# EAGLE design umodular_ctrl16 (EAGLE 7.2.0)

## Sheet 1 of 2
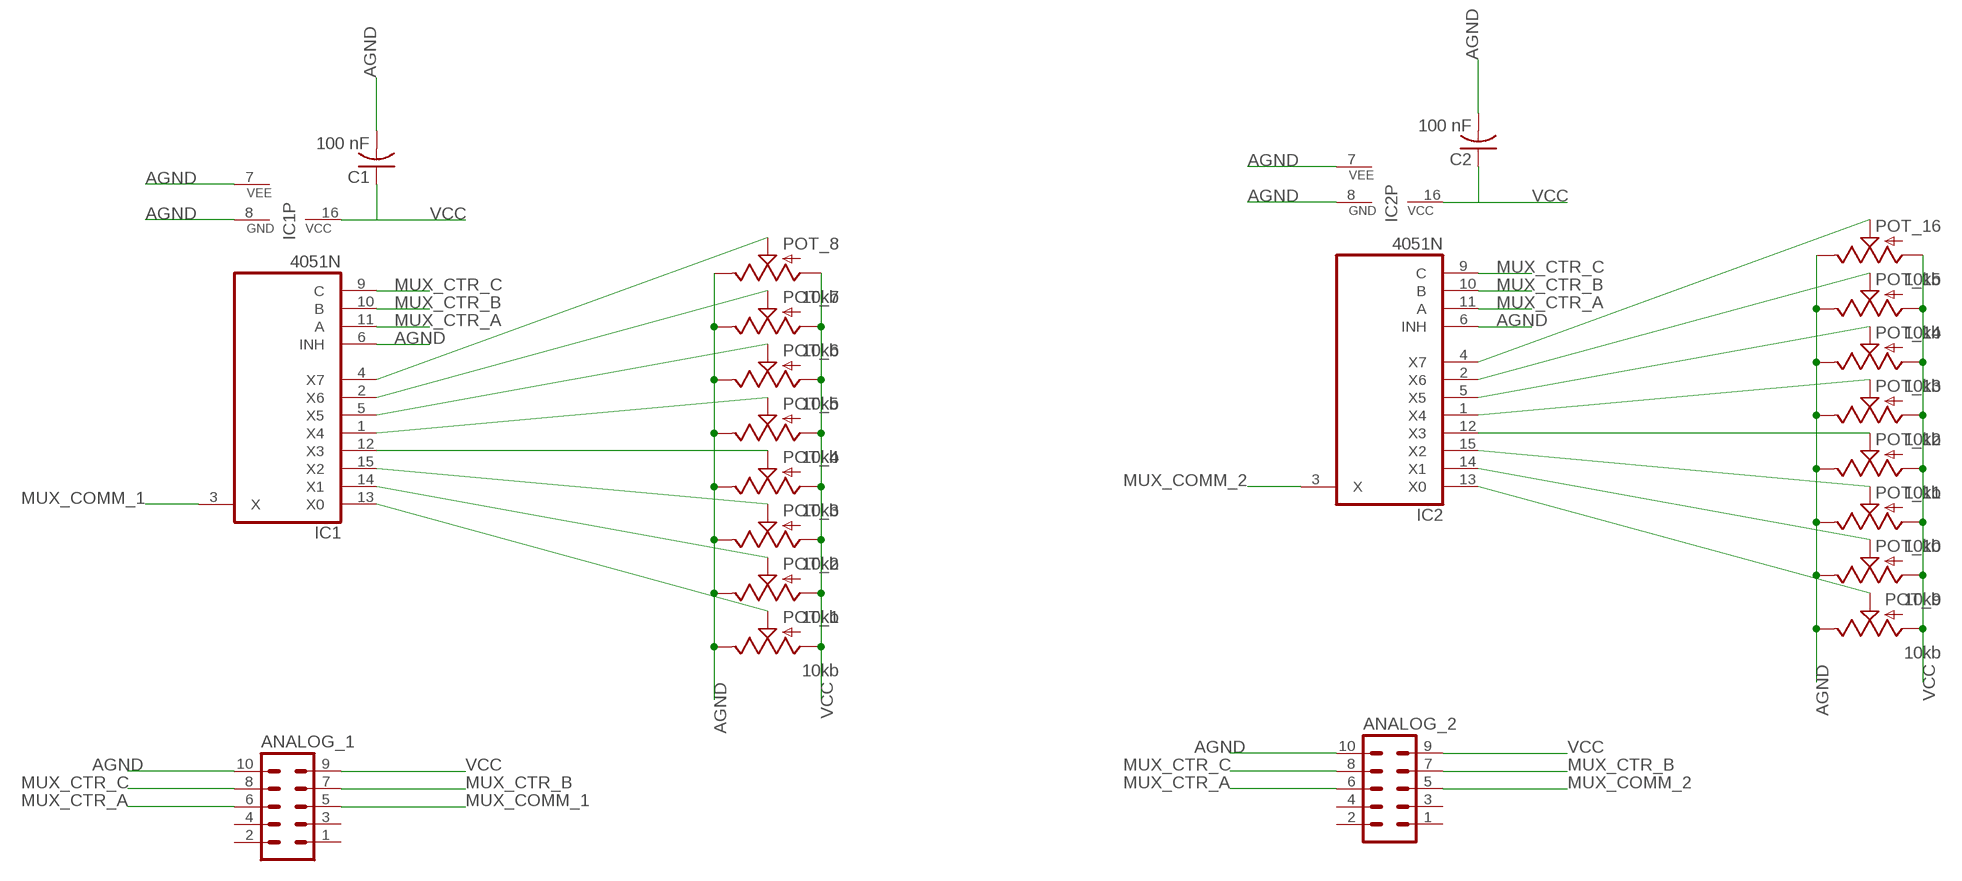
[diagram p0: schematic, sheet 1]

### Parts
ANALOG_1  MA05-2  [MA05-2]
ANALOG_2  MA05-2  [MA05-2]
C1  100 nF  C-US050-024X044  [C050-024X044]
C2  100 nF  C-US050-024X044  [C050-024X044]
IC1  4051N  [DIL16]
IC2  4051N  [DIL16]
POT_1  10kb  POT  [ALPS_POT]
POT_2  10kb  POT  [ALPS_POT]
POT_3  10kb  POT  [ALPS_POT]
POT_4  10kb  POT  [ALPS_POT]
POT_5  10kb  POT  [ALPS_POT]
POT_6  10kb  POT  [ALPS_POT]
POT_7  10kb  POT  [ALPS_POT]
POT_8  10kb  POT  [ALPS_POT]
POT_9  10kb  POT  [ALPS_POT]
POT_10  10kb  POT  [ALPS_POT]
POT_11  10kb  POT  [ALPS_POT]
POT_12  10kb  POT  [ALPS_POT]
POT_13  10kb  POT  [ALPS_POT]
POT_14  10kb  POT  [ALPS_POT]
POT_15  10kb  POT  [ALPS_POT]
POT_16  10kb  POT  [ALPS_POT]

### Nets
AGND: ANALOG_1.10 ANALOG_2.10 C1.2 C2.2 IC1.6(INH) IC1.7(VEE) IC1.8(GND) IC2.6(INH) IC2.7(VEE) IC2.8(GND) POT_1.P$1(E) POT_2.P$1(E) POT_3.P$1(E) POT_4.P$1(E) POT_5.P$1(E) POT_6.P$1(E) POT_7.P$1(E) POT_8.P$1(E) POT_9.P$1(E) POT_10.P$1(E) POT_11.P$1(E) POT_12.P$1(E) POT_13.P$1(E) POT_14.P$1(E) POT_15.P$1(E) POT_16.P$1(E)
MUX_COMM_1: ANALOG_1.5 IC1.3(X)
MUX_COMM_2: ANALOG_2.5 IC2.3(X)
MUX_CTR_A: ANALOG_1.6 ANALOG_2.6 IC1.11(A) IC2.11(A)
MUX_CTR_B: ANALOG_1.7 ANALOG_2.7 IC1.10(B) IC2.10(B)
MUX_CTR_C: ANALOG_1.8 ANALOG_2.8 IC1.9(C) IC2.9(C)
N$1: IC1.13(X0) POT_1.P$2(S)
N$10: IC1.14(X1) POT_2.P$2(S)
N$11: IC1.15(X2) POT_3.P$2(S)
N$12: IC1.12(X3) POT_4.P$2(S)
N$13: IC1.1(X4) POT_5.P$2(S)
N$14: IC1.5(X5) POT_6.P$2(S)
N$15: IC1.2(X6) POT_7.P$2(S)
N$16: IC1.4(X7) POT_8.P$2(S)
N$274: IC2.13(X0) POT_9.P$2(S)
N$275: IC2.14(X1) POT_10.P$2(S)
N$276: IC2.15(X2) POT_11.P$2(S)
N$277: IC2.12(X3) POT_12.P$2(S)
N$278: IC2.1(X4) POT_13.P$2(S)
N$279: IC2.5(X5) POT_14.P$2(S)
N$280: IC2.2(X6) POT_15.P$2(S)
N$281: IC2.4(X7) POT_16.P$2(S)
VCC: ANALOG_1.9 ANALOG_2.9 C1.1 C2.1 IC1.16(VCC) IC2.16(VCC) POT_1.P$3(A) POT_2.P$3(A) POT_3.P$3(A) POT_4.P$3(A) POT_5.P$3(A) POT_6.P$3(A) POT_7.P$3(A) POT_8.P$3(A) POT_9.P$3(A) POT_10.P$3(A) POT_11.P$3(A) POT_12.P$3(A) POT_13.P$3(A) POT_14.P$3(A) POT_15.P$3(A) POT_16.P$3(A) ; also sheet 2
Unconnected: ANALOG_1.1 ANALOG_1.2 ANALOG_1.3 ANALOG_1.4 ANALOG_2.1 ANALOG_2.2 ANALOG_2.3 ANALOG_2.4

## Sheet 2 of 2
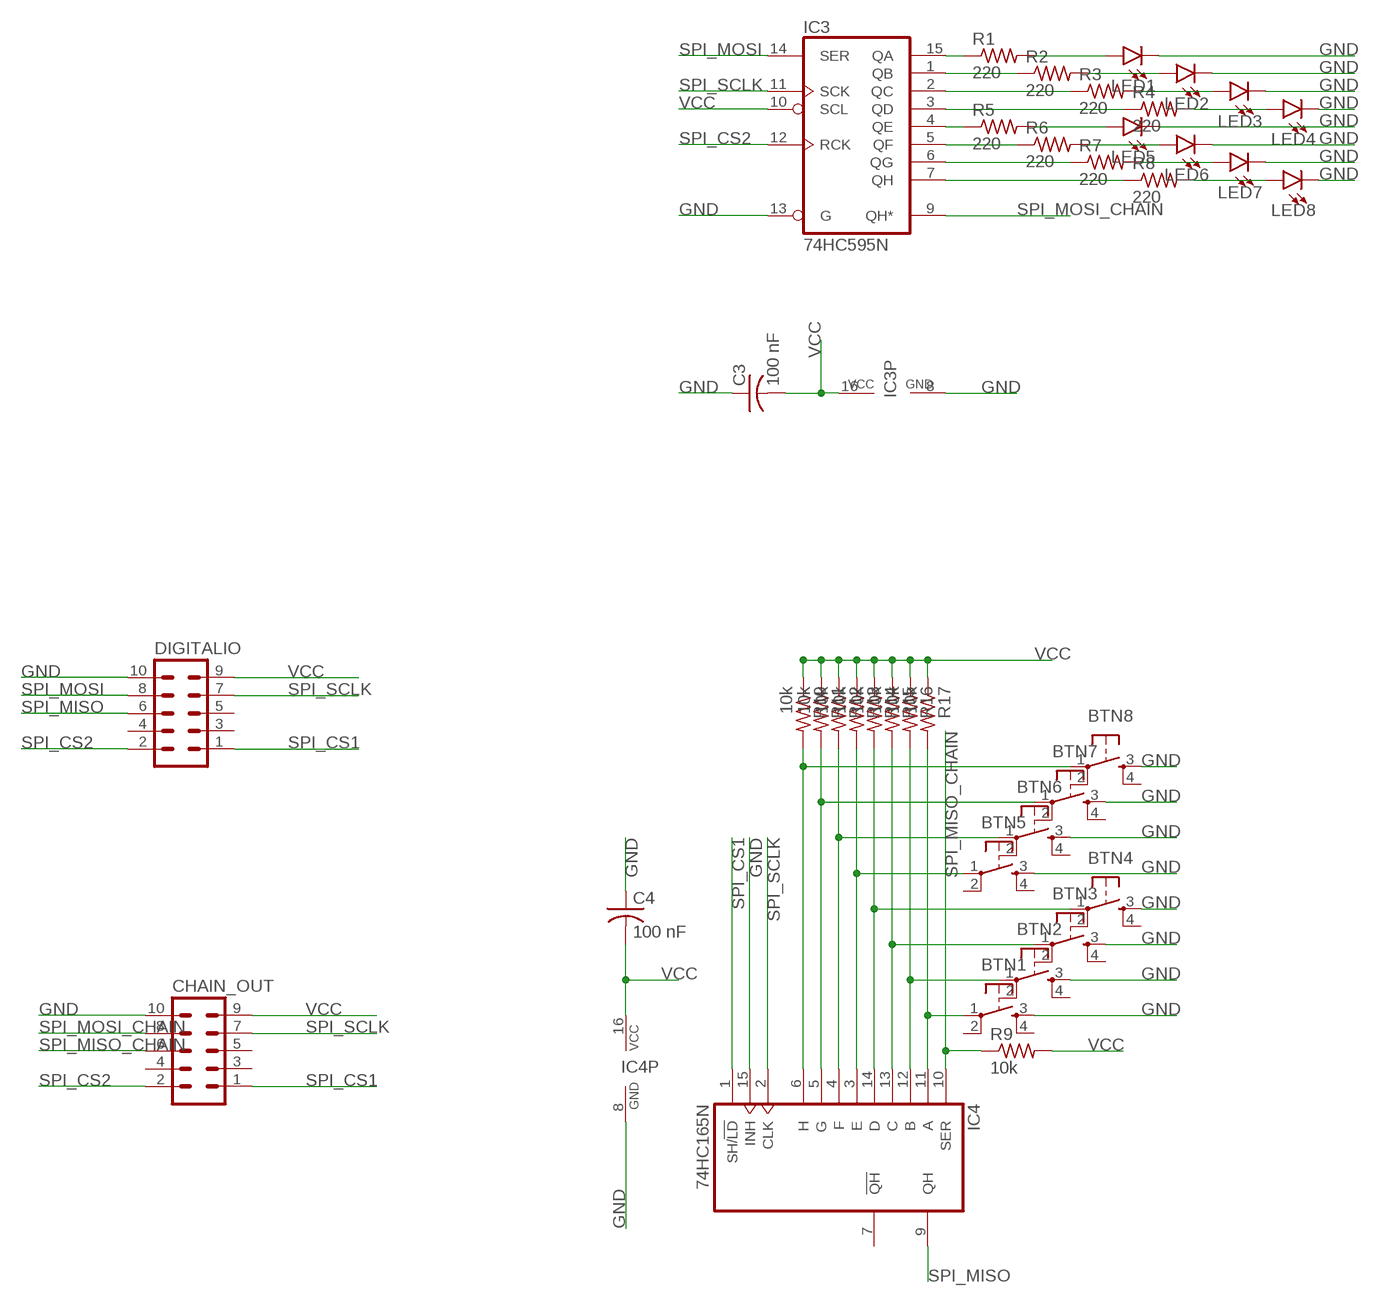
[diagram p1: schematic, sheet 2]

### Parts
BTN1  TAC_SWITCHPTH  [TACTILE-PTH]
BTN2  TAC_SWITCHPTH  [TACTILE-PTH]
BTN3  TAC_SWITCHPTH  [TACTILE-PTH]
BTN4  TAC_SWITCHPTH  [TACTILE-PTH]
BTN5  TAC_SWITCHPTH  [TACTILE-PTH]
BTN6  TAC_SWITCHPTH  [TACTILE-PTH]
BTN7  TAC_SWITCHPTH  [TACTILE-PTH]
BTN8  TAC_SWITCHPTH  [TACTILE-PTH]
C3  100 nF  C-US050-024X044  [C050-024X044]
C4  100 nF  C-US050-024X044  [C050-024X044]
CHAIN_OUT  MA05-2  [MA05-2]
DIGITALIO  MA05-2  [MA05-2]
IC3  74HC595N  [DIL16]
IC4  74HC165N  [DIL16]
LED1  LED3MM  [LED_3MM]
LED2  LED3MM  [LED_3MM]
LED3  LED3MM  [LED_3MM]
LED4  LED3MM  [LED_3MM]
LED5  LED3MM  [LED_3MM]
LED6  LED3MM  [LED_3MM]
LED7  LED3MM  [LED_3MM]
LED8  LED3MM  [LED_3MM]
R1  220  R-US_0204/7  [0204/7]
R2  220  R-US_0204/7  [0204/7]
R3  220  R-US_0204/7  [0204/7]
R4  220  R-US_0204/7  [0204/7]
R5  220  R-US_0204/7  [0204/7]
R6  220  R-US_0204/7  [0204/7]
R7  220  R-US_0204/7  [0204/7]
R8  220  R-US_0204/7  [0204/7]
R9  10k  R-US_0204/7  [0204/7]
R10  10k  R-US_0204/7  [0204/7]
R11  10k  R-US_0204/7  [0204/7]
R12  10k  R-US_0204/7  [0204/7]
R13  10k  R-US_0204/7  [0204/7]
R14  10k  R-US_0204/7  [0204/7]
R15  10k  R-US_0204/7  [0204/7]
R16  10k  R-US_0204/7  [0204/7]
R17  10k  R-US_0204/7  [0204/7]

### Nets
GND: BTN1.3 BTN2.3 BTN3.3 BTN4.3 BTN5.3 BTN6.3 BTN7.3 BTN8.3 C3.1 C4.1 CHAIN_OUT.10 DIGITALIO.10 IC3.8(GND) IC3.13(G) IC4.8(GND) IC4.15(INH) LED1.K(C) LED2.K(C) LED3.K(C) LED4.K(C) LED5.K(C) LED6.K(C) LED7.K(C) LED8.K(C)
N$2: BTN1.1 IC4.11(A) R17.2
N$3: BTN2.1 IC4.12(B) R16.2
N$4: BTN3.1 IC4.13(C) R15.2
N$5: BTN4.1 IC4.14(D) R14.2
N$6: BTN5.1 IC4.3(E) R13.2
N$7: BTN6.1 IC4.4(F) R12.2
N$8: BTN7.1 IC4.5(G) R11.2
N$9: BTN8.1 IC4.6(H) R10.2
N$75: IC3.7(QH) R8.1
N$76: IC3.6(QG) R7.1
N$77: IC3.5(QF) R6.1
N$78: IC3.4(QE) R5.1
N$79: IC3.3(QD) R4.1
N$80: IC3.2(QC) R3.1
N$81: IC3.1(QB) R2.1
N$82: IC3.15(QA) R1.1
N$83: LED1.A R1.2
N$84: LED2.A R2.2
N$85: LED4.A R4.2
N$86: LED3.A R3.2
N$87: LED5.A R5.2
N$88: LED6.A R6.2
N$89: LED7.A R7.2
N$90: LED8.A R8.2
SPI_CS1: CHAIN_OUT.1 DIGITALIO.1 IC4.1(SH/!LD)
SPI_CS2: CHAIN_OUT.2 DIGITALIO.2 IC3.12(RCK)
SPI_MISO: DIGITALIO.6 IC4.9(QH)
SPI_MISO_CHAIN: CHAIN_OUT.6 IC4.10(SER) R9.1
SPI_MOSI: DIGITALIO.8 IC3.14(SER)
SPI_MOSI_CHAIN: CHAIN_OUT.8 IC3.9(QH*)
SPI_SCLK: CHAIN_OUT.7 DIGITALIO.7 IC3.11(SCK) IC4.2(CLK)
VCC: C3.2 C4.2 CHAIN_OUT.9 DIGITALIO.9 IC3.10(SCL) IC3.16(VCC) IC4.16(VCC) R9.2 R10.1 R11.1 R12.1 R13.1 R14.1 R15.1 R16.1 R17.1 ; also sheet 1
Unconnected: BTN1.2 BTN1.4 BTN2.2 BTN2.4 BTN3.2 BTN3.4 BTN4.2 BTN4.4 BTN5.2 BTN5.4 BTN6.2 BTN6.4 BTN7.2 BTN7.4 BTN8.2 BTN8.4 CHAIN_OUT.3 CHAIN_OUT.4 CHAIN_OUT.5 DIGITALIO.3 DIGITALIO.4 DIGITALIO.5 IC4.7(!QH)

## Library data of the parts
ANALOG_1 ANALOG_2 CHAIN_OUT DIGITALIO = con-lstb:MA05-2: PIN HEADER; OC_FARNELL: unknown; OC_NEWARK: unknown
BTN1-BTN8 = SparkFun-Electromechanical_mod:TAC_SWITCH: Momentary Switch Button commonly used for reset or general input. Spark Fun Electronics SKU : COM-00097 SMT- SWCH-08247
C1-C4 = rcl:C-US: CAPACITOR, American symbol
IC1 IC2 = 40xx:4051: 8-channel ANALOG MULTIPLEXER
IC3 = 74xx-eu:74*595: 8-bit SHIFT REGISTER, output latch
IC4 = 74xx-eu:74*165: 8-bit parallel load SHIFT REGISTER
LED1-LED8 = SparkFun-LED:LED: LED (Generic) Standard schematic elements and footprints for 5mm, 3mm, 1206, and 0603 sized LEDs. Generic LEDs with no color specified.; PROD_ID: DIO-08794
POT_1-POT_16 = SparkFun-Electromechanical_mod:POT
R1-R8 = rcl:R-US_: RESISTOR, American symbol
R9-R17 = resistor:R-US_: RESISTOR, American symbol

## Board
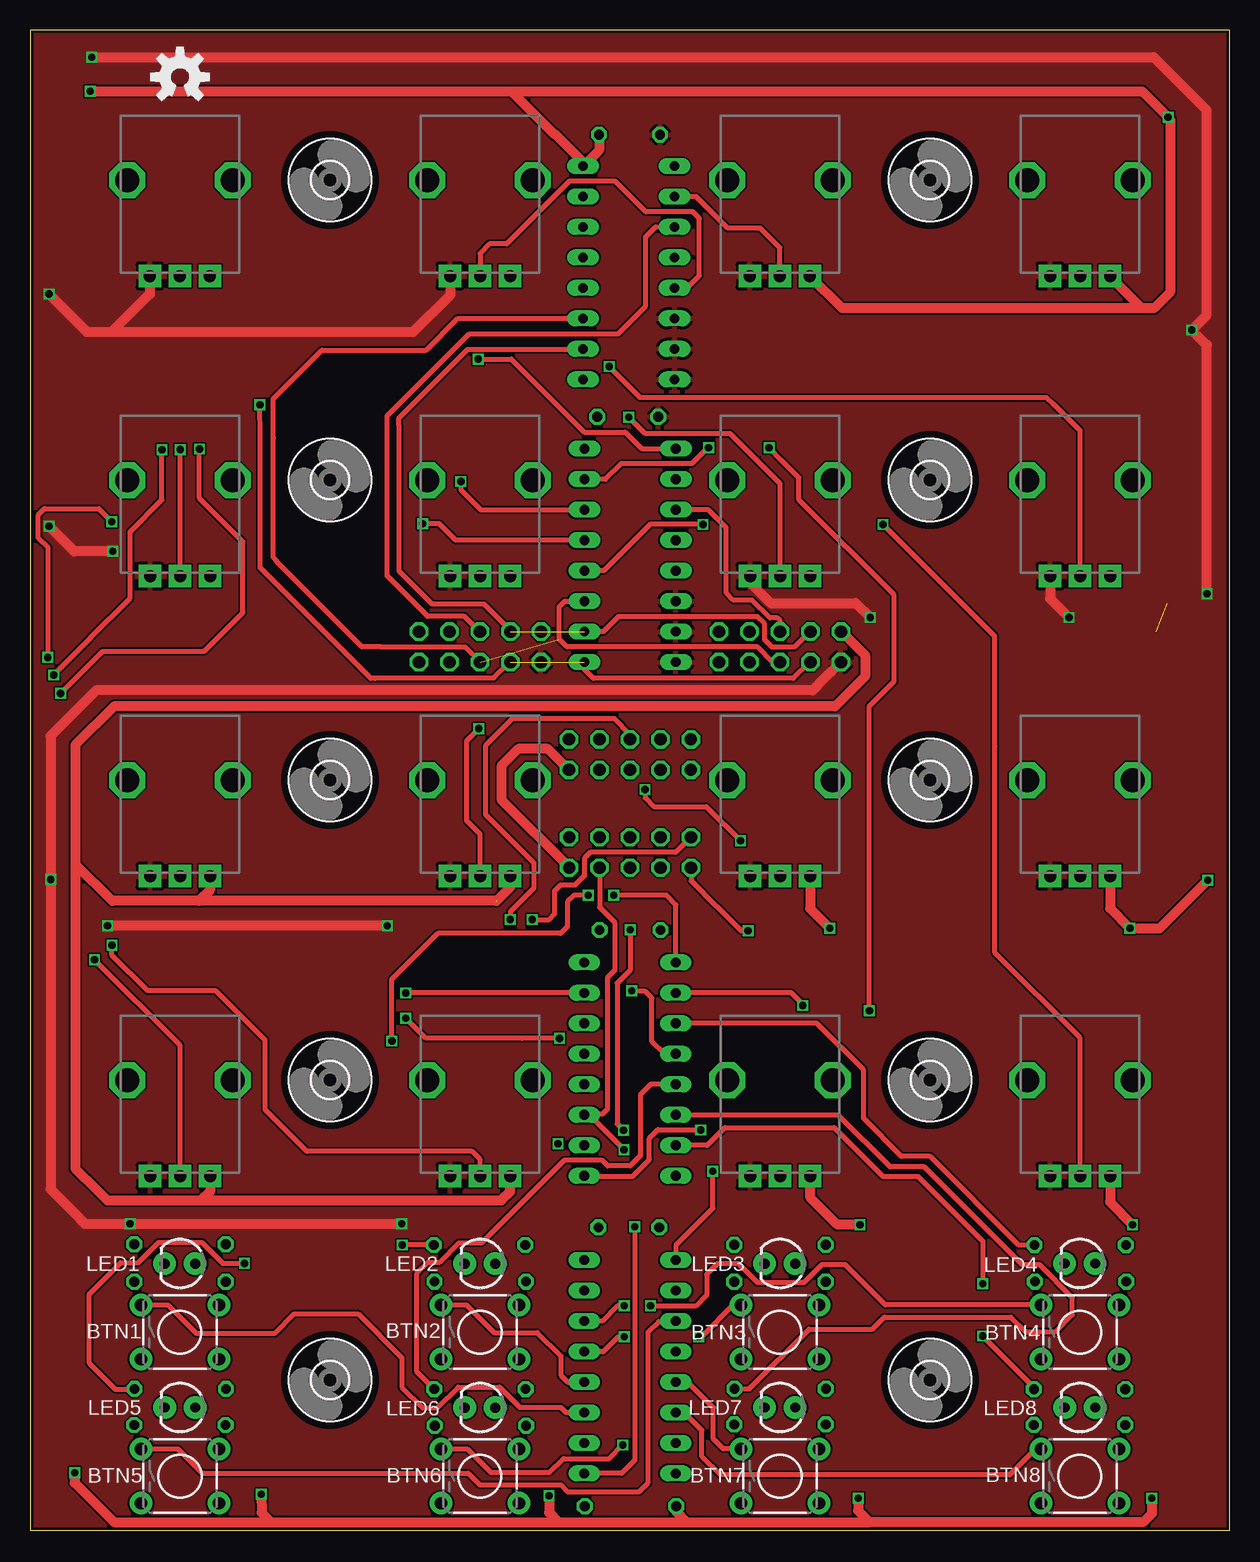
[diagram p2: board, top side]
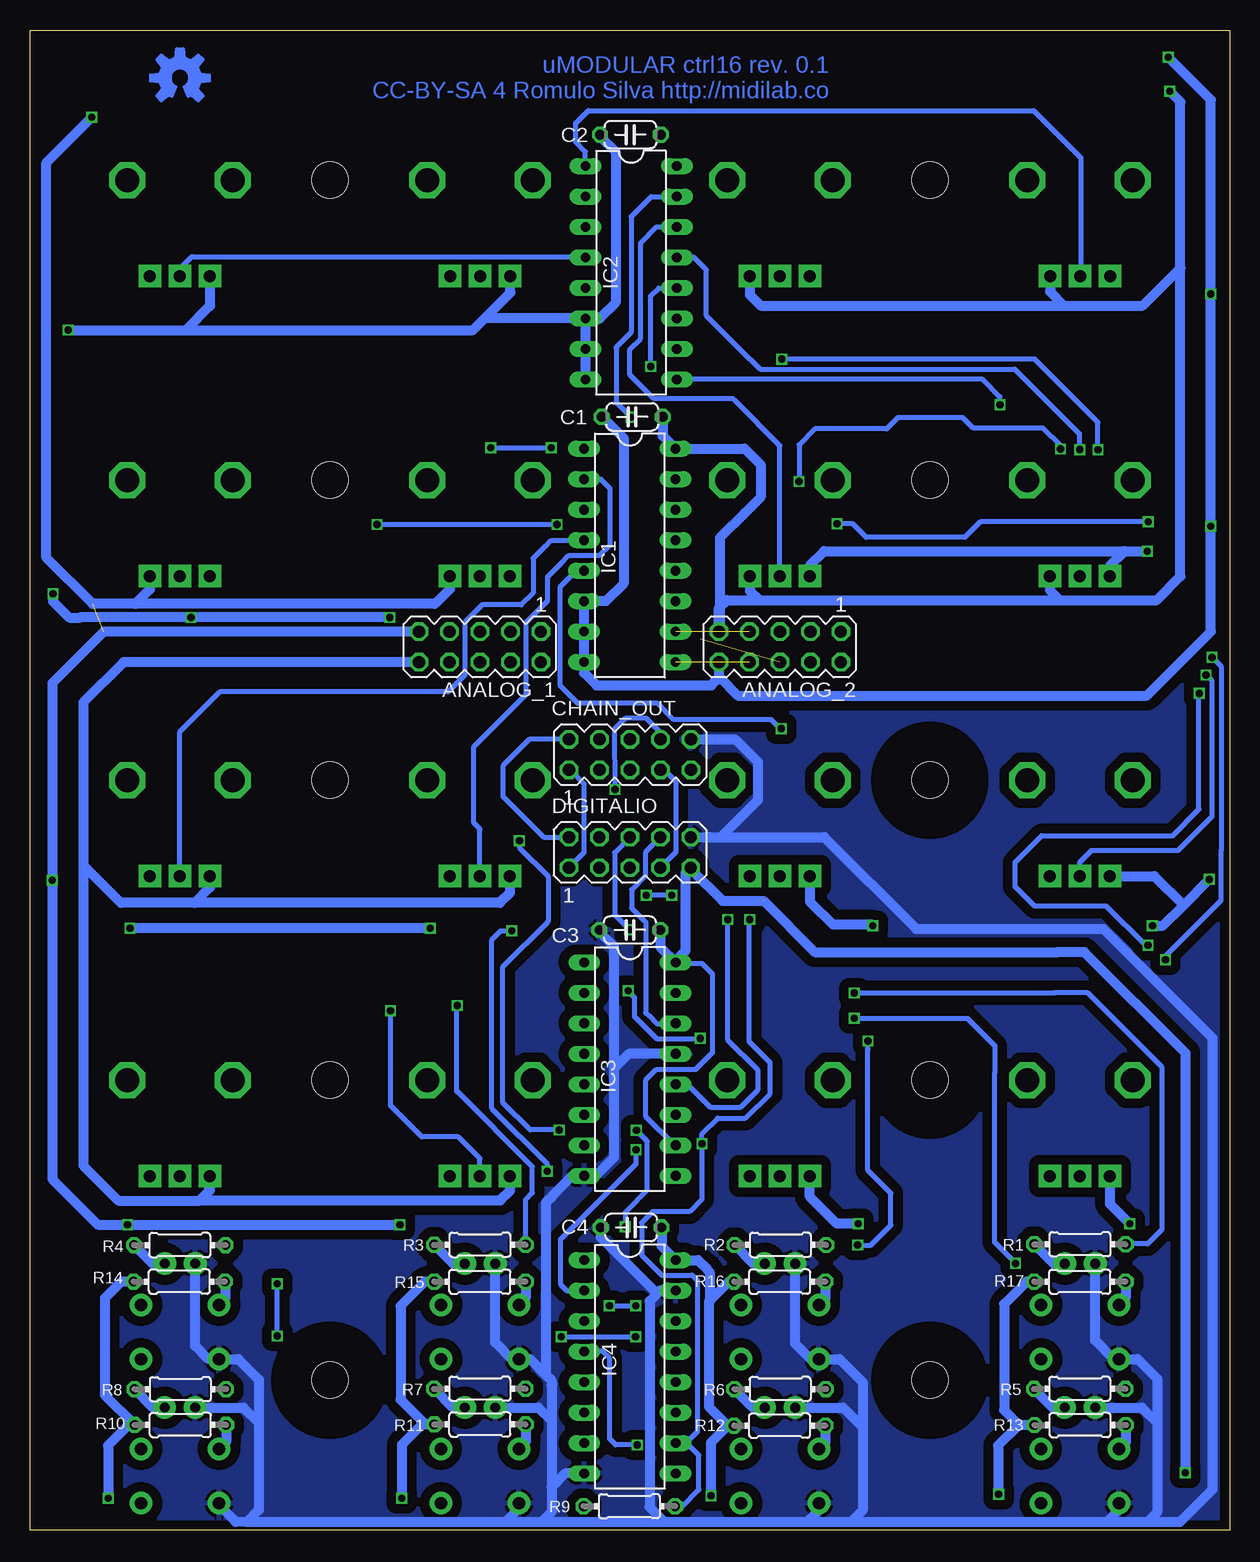
[diagram p3: board, bottom side, seen from below]

Size 100 x 125 mm. Coordinates in mm from the lower left corner, seen from the top.
Outline: 0,0 100,0 100,125 0,125 0,0
Copper layers (1*16): Top 0.035mm / dielectric 1.5mm / Bottom 0.035mm
Design rules "SeeedStudio_2layer_DRU_no_angle_20140221": minimum track width 6mil, minimum drill 12mil, track to track 6mil, track to pad 6mil, pad to pad 6mil, via to via 6mil, smd to smd 0mil, copper to edge 10mil, drill to drill 10mil, minimum pad ring 10mil, minimum via ring 6mil, stop-mask expansion 2mil, vias tented up to drill 100mil, thermal gap 10mil

### Footprints (pad centres in the part's own frame; a part is rotated, then mirrored left to right if it is on the bottom)
MA05-2 = drill 1.016 octagon: 1 -5.08,-1.27; 2 -5.08,1.27; 3 -2.54,-1.27; 4 -2.54,1.27; 5 0,-1.27; 6 0,1.27; 7 2.54,-1.27; 8 2.54,1.27; 9 5.08,-1.27; 10 5.08,1.27
TACTILE-PTH = drill 1.016 pad 1.88: 1 -3.251,2.261; 2 3.251,2.261; 3 -3.251,-2.261; 4 3.251,-2.261
C050-024X044 = drill 0.813 octagon: 1 -2.54,0; 2 2.54,0
DIL16 = drill 0.813 long: 1 -8.89,-3.81; 2 -6.35,-3.81; 3 -3.81,-3.81; 4 -1.27,-3.81; 5 1.27,-3.81; 6 3.81,-3.81; 7 6.35,-3.81; 8 8.89,-3.81; 9 8.89,3.81; 10 6.35,3.81; 11 3.81,3.81; 12 1.27,3.81; 13 -1.27,3.81; 14 -3.81,3.81; 15 -6.35,3.81; 16 -8.89,3.81
LED_3MM = drill 0.813 pad 1.88: A -1.27,0; K 1.27,0
ALPS_POT = drill 1 pad 1.88 square: P$1 8,-2.5; P$2 8,0; P$3 8,2.5 | drill 2 octagon: P$4 0,-4.4; P$5 0,4.4
0204/7 = drill 0.813 octagon: 1 -3.81,0; 2 3.81,0
3,0 = hole 3: 0,0

### Placement (x,y rotation side)
ANALOG_1  62.5,73.6 180 bottom
ANALOG_2  37.5,73.6 180 bottom
BTN1  12.49,16.5 0 top
BTN2  37.5,16.5 0 top
BTN3  62.49,16.5 0 top
BTN4  87.5,16.5 0 top
BTN5  12.5,4.5 0 top
BTN6  37.49,4.5 0 top
BTN7  62.5,4.5 0 top
BTN8  87.5,4.5 0 top
C1  49.81,92.77 180 bottom
C2  49.96,116.28 180 bottom
C3  50.01,50.01 0 bottom
C4  49.91,25.22 0 bottom
CHAIN_OUT  49.99,64.62 0 bottom
DIGITALIO  50.01,56.47 0 bottom
IC1  50.01,81.22 270 bottom
IC2  49.9,104.78 270 bottom
IC3  50,38.41 270 bottom
IC4  50,13.61 270 bottom
LED1  12.49,22.2 180 top
LED2  37.5,22.2 180 top
LED3  62.49,22.2 180 top
LED4  87.5,22.2 180 top
LED5  12.5,10.21 180 top
LED6  37.5,10.2 180 top
LED7  62.49,10.21 180 top
LED8  87.5,10.21 180 top
POT_1  12.5,37.5 270 top
POT_2  37.5,37.5 270 top
POT_3  62.5,37.5 270 top
POT_4  87.5,37.5 270 top
POT_5  12.5,62.5 270 top
POT_6  37.5,62.5 270 top
POT_7  62.5,62.5 270 top
POT_8  87.5,62.5 270 top
POT_9  12.5,87.5 270 top
POT_10  37.5,87.5 270 top
POT_11  62.5,87.5 270 top
POT_12  87.5,87.5 270 top
POT_13  12.49,112.5 270 top
POT_14  37.5,112.5 270 top
POT_15  62.49,112.5 270 top
POT_16  87.5,112.5 270 top
R1  12.5,23.82 180 bottom
R2  37.46,23.76 180 bottom
R3  62.5,23.77 180 bottom
R4  87.52,23.75 180 bottom
R5  12.52,11.77 180 bottom
R6  37.49,11.74 180 bottom
R7  62.52,11.78 180 bottom
R8  87.47,11.73 180 bottom
R9  50.05,1.99 180 bottom
R10  87.47,8.77 0 bottom
R11  62.5,8.8 0 bottom
R12  37.53,8.7 0 bottom
R13  12.49,8.76 0 bottom
R14  87.55,20.7 0 bottom
R15  62.5,20.7 0 bottom
R16  37.52,20.7 0 bottom
R17  12.51,20.7 0 bottom
U$1  [3,0]  25,87.5 0 top
U$2  [3,0]  25,12.5 0 top
U$3  [3,0]  25,37.5 0 top
U$4  [3,0]  25,112.5 0 top
U$5  [3,0]  75,87.5 0 top
U$6  [3,0]  75,12.5 0 top
U$8  [3,0]  25,62.5 0 top
U$9  [OSHW-LOGO-M]  12.5,121.09 0 top
U$10  [OSHW-LOGO-M]  87.5,121.01 0 top
U$11  [3,0]  75,37.5 0 top
U$12  [3,0]  75,112.5 0 top
U$13  [3,0]  75,62.5 0 top

### Tracks (layer width: path | path; a pad name or v marks a point on that pad's centre or on a via)
AGND  (via drill 0.6)
  Top 0.813: ANALOG_1.10 67.55,72.33 65.61,70.39 65.61,70.38 65.2,69.97 5.5,69.97 1.72,66.19 v1.72,54.22 1.72,28.41 4.12,26.01 4.12,25.99 4.37,25.74 4.37,25.73 4.58,25.52 v8.34,25.52 v30.97,25.52 v30.98,25.53 | v29.77,50.36 v6.46,50.36 | v5.15,122.74 93.63,122.74 98,118.37 98,101.18 v96.82,100 98.07,98.75 v98.07,78.03 v98.08,78.02 | POT_14.P$1 35,102.91 31.91,99.82 6.79,99.82 | 6.79,99.82 4.77,99.82 v1.59,103 | POT_13.P$1 9.99,103.03 6.79,99.82 | POT_11.P$1 59.99,78.98 61.72,77.25 68.81,77.25 v70.01,76.05 | v6.9,81.56 3.68,81.56 v1.59,83.65 | POT_12.P$1 85,77.63 v86.58,76.05
  Bottom 0.813: v30.98,25.53 32.75,25.53 35.01,27.79 POT_2.P$1 | POT_1.P$1 10,27.18 v8.34,25.52 | ANALOG_1.10 92.2,72.33 95.55,68.98 95.55,55.4 | 95.55,55.4 95.55,30.36 92.64,27.45 85.85,27.45 85.04,28.26 85.04,29.46 POT_4.P$1 85,28.32 85.85,27.47 60.8,27.47 59.99,28.28 POT_3.P$1 | 86.28,52.27 60.84,52.27 59.99,53.12 POT_7.P$1 | 86.28,52.27 92.42,52.27 95.55,55.4 | POT_8.P$1 85,53.55 86.28,52.27 | POT_6.P$1 35,52.38 33.09,50.47 29.88,50.47 v29.77,50.36 | v6.46,50.36 5.58,50.36 3.87,52.07 | 3.87,52.07 v1.72,54.22 | POT_5.P$1 6.3,54.5 3.87,52.07 | ANALOG_2.10 42.58,71.11 42.53,71.06 | 42.53,71.06 41,69.53 6.92,69.53 1.59,74.86 v1.59,83.65 v1.59,103 1.59,119.18 v5.15,122.74 | v96.82,100 87.01,100 | 87.01,100 63.09,100 62.12,100.97 | 62.12,100.97 59.97,103.12 59.97,104.48 POT_15.P$1 | POT_16.P$1 85,102.01 87.01,100 | 42.53,71.06 43.21,70.39 52.77,70.39 53.82,71.44 IC1.8 IC1.7 IC1.6 52,77.41 50.53,78.88 50.53,91 52.3,92.77 C1.2 | IC2.6 IC2.7 IC2.8 | IC2.6 62.12,100.97 | POT_10.P$1 35,80.39 33.82,81.57 8.78,81.57 | 8.78,81.57 v6.91,81.57 v6.9,81.56 | POT_9.P$1 10,80.35 8.78,81.57 | C2.2 52.5,116.16 51.2,114.86 51.2,102.28 52.51,100.97 IC2.6 | v70.01,76.05 v86.58,76.05 95.8,76.05 95.81,76.04 96.72,76.04 98.08,77.4 v98.08,78.02
  pour Top: -0.05,125.05 100.38,125.05 100.38,-0.22 -0.05,-0.22 -0.05,124.43
GND
  Bottom 0.813: 42.43,57.74 DIGITALIO.10 43.35,57.74 | 6.88,0.67 4.17,0.67 1.47,3.37 1.47,41.02 10.55,50.1 26.15,50.1 33.79,57.74 42.43,57.74 | 6.88,0.67 10.26,0.67 | 10.26,0.67 31.59,0.67 | 31.59,0.67 35.28,0.67 | 35.28,0.67 47.11,0.67 | 47.11,0.67 57.38,0.67 | 57.38,0.67 60.38,0.67 | 60.38,0.67 81.95,0.67 | 81.95,0.67 82.87,0.69 84.24,2.06 BTN8.3 | BTN5.3 9.25,1.68 10.26,0.67 | BTN6.3 34.24,1.71 35.28,0.67 | BTN7.3 59.25,1.8 60.38,0.67 | 6.07,8.93 6.07,12.61 7.7,14.24 BTN1.3 9.68,14.24 11.24,15.8 11.24,22.18 LED1.K | 6.07,8.93 6.07,1.48 6.88,0.67 | 30.61,8.57 30.61,12.33 32.52,14.24 BTN2.3 34.94,14.24 36.24,15.54 LED2.K | 30.61,8.57 30.61,1.65 31.59,0.67 | 57,12.92 58.32,14.24 BTN3.3 59.84,14.24 61.24,15.64 61.24,22.18 LED3.K | 56.53,12.04 56.53,12.45 57,12.92 | 56.53,12.04 56.53,9.11 | 56.53,9.11 56.53,3.57 | 56.53,3.57 56.53,1.52 57.38,0.67 | 80.93,8.93 80.93,12.54 82.63,14.24 BTN4.3 85.14,14.24 86.24,15.34 LED4.K | 80.93,8.93 80.93,1.69 81.95,0.67 | LED5.K 7.34,10.21 6.07,8.93 | LED6.K 32.24,10.2 30.61,8.57 | LED7.K 57.62,10.21 56.53,9.11 | LED8.K 82.2,10.21 80.93,8.93 | IC4.15 47.48,19.95 47.73,19.7 | 47.73,19.7 48.35,19.08 48.35,1.91 47.11,0.67 | IC4.8 55.38,4.71 56.53,3.57 | 56.45,12.12 56.53,12.04 | C4.1 52.45,24.41 47.73,19.7 | C3.1 52.55,49.87 51.33,48.65 51.33,38.44 | 51.33,38.44 51.33,31.03 52.83,29.53 IC3.8 54.8,29.52 56.31,28.02 56.31,28.01 56.45,27.87 56.45,27.86 57,27.31 57,12.92 | IC3.13 50.09,39.69 51.33,38.44 | CHAIN_OUT.10 41.23,65.9 39.34,64.01 39.34,60.83 42.43,57.74
  pour Bottom (isolate 0.813): -0.02,125.05 100.08,125.2 100.41,-0.2 -0.03,0 0.25,79.62
MUX_COMM_1
  Top 0.406: ANALOG_1.5 62.5,75.8 62.29,76.01 61.65,76.01 60.16,77.5 58.61,77.5 58,78.11 58,83.54 56.51,85.03 IC1.3
MUX_COMM_2
  Top 0.406: ANALOG_2.5 37.47,74.87 36.19,76.15 33.13,76.15 29.77,79.51 29.77,92.85 36.61,99.69 49,99.69 51.3,101.99 51.3,107.76 52.13,108.59 IC2.3
MUX_CTR_A  (1 unrouted)
  Top 0.406: ANALOG_1.6 61.9,72.33 60.63,73.6 44.73,73.6 44.1,74.23 44.1,76.94 44.57,77.41 IC1.11 | ANALOG_2.6 36.26,73.58 29.28,73.58 29.26,73.6 27.66,73.6 20.62,80.64 20.62,80.68 20.47,80.83 20.47,80.85 20.29,81.03 20.29,90.99 20.28,91 20.28,94.29 24.32,98.33 33.01,98.33 35.65,100.97 IC2.11
MUX_CTR_B  (1 unrouted)
  Top 0.406: ANALOG_1.7 64.96,74.87 63.67,73.58 61.84,73.58 61.21,74.21 61.21,75.52 60.62,76.11 49.02,76.11 47.78,74.87 IC1.10 | ANALOG_2.7 40.04,74.97 37.84,77.17 33.5,77.17 30.75,79.92 30.75,92.05 30.74,92.06 30.74,92.66 36.47,98.39 46.05,98.39 IC2.10
MUX_CTR_C  (via drill 0.6)  (1 unrouted)
  Top 0.406: ANALOG_1.8 64.96,72.33 63.61,70.98 46.94,70.98 46.2,71.72 IC1.9 | ANALOG_2.8 39.98,72.33 38.66,71.01 38.66,71 38.65,70.99 28.76,70.99 28.75,70.98 28.39,70.98 19.18,80.19 19.18,91.12 19.17,91.13 v19.16,93.77
  Bottom 0.406: v19.16,93.77 19.17,94.45 20.62,95.9 IC2.9
N$1  (via drill 0.6)
  Top 0.406: POT_1.P$2 12.5,40.4 v5.37,47.53 | v1.49,72.72 v1.5,72.72 1.5,81.86 0.69,82.67 0.69,84.6 1.2,85.11 5.73,85.11 v6.82,84.02 | IC1.13 35.47,82.49 34.1,83.86 v32.75,83.86 v32.74,83.85
  Bottom 0.406: v5.37,47.53 5.37,47.84 0.73,52.48 0.73,56.63 0.7,56.66 0.7,71.93 v1.49,72.72 | v6.82,84.02 20.8,84.02 22.09,82.73 30.31,82.73 31.43,83.85 v32.74,83.85
N$2
  Top 0.406: BTN1.1 11.5,18.76 13.85,16.41 20.42,16.41 22.02,18.01 27.35,18.01 30.99,14.37 30.99,11.92 32.72,10.19 33.94,10.19 35.67,11.92 39.14,11.92 40.83,10.23 44.24,10.23 44.66,9.81 46.17,9.81 IC4.11
  Bottom 0.813: R17.2 8.7,19.31 BTN1.1
N$3
  Top 0.406: BTN2.1 36.37,18.76 38.67,16.46 42.29,16.46 44.24,14.51 44.24,12.91 44.83,12.32 46.17,12.32 IC4.12
  Bottom 0.813: R16.2 33.71,19.3 BTN2.1
N$4  (via drill 0.6)
  Top 0.406: BTN3.1 58.61,18.76 55.98,16.13 55.81,16.2 v55.73,16.12 | v49.53,16.1 49.02,16.1 47.76,14.85 46.22,14.85 IC4.13
  Bottom 0.406: v55.73,16.12 v49.53,16.1
  Bottom 0.813: R15.2 58.69,19.31 BTN3.1
N$5  (via drill 0.6)
  Top 0.406: BTN4.1 71.28,18.76 67.92,22.12 65.99,22.12 64.49,20.62 60.63,20.62 59.05,22.2 57.27,22.2 56.38,21.31 56.38,19.59 55.46,18.67 51.73,18.67 v51.71,18.69 | v49.51,18.69 48.95,18.69 47.68,17.42 IC4.14
  Bottom 0.406: v51.71,18.69 v49.51,18.69
  Bottom 0.813: R14.2 83.74,19.26 BTN4.1
N$6
  Top 0.406: BTN5.1 12.32,6.76 14.34,4.74 36.51,4.74 37.48,3.77 44.23,3.77 44.79,3.21 50.78,3.21 51.52,3.95 51.52,16.51 52.38,17.37 53.77,17.37 IC4.3
  Bottom 0.813: R13.2 8.68,7.33 BTN5.1
N$7  (via drill 0.6)
  Top 0.406: BTN6.1 36.43,6.76 38.39,4.8 43.29,4.8 44.44,5.95 48.26,5.95 v49.4,7.09
  Bottom 0.406: v49.4,7.09 51.2,7.09 51.7,7.59 51.7,14.3 52.29,14.89 53.8,14.89 IC4.4
  Bottom 0.813: R12.2 33.72,7.28 BTN6.1
N$8
  Top 0.406: BTN7.1 57.77,6.76 56.94,7.59 56.94,10.21 54.9,12.25 53.9,12.25 IC4.5
  Bottom 0.813: R11.2 58.69,7.32 BTN7.1
N$9
  Top 0.406: BTN8.1 83.83,6.76 81.66,4.59 57.53,4.59 55.99,6.13 55.99,8.32 54.61,9.7 53.91,9.7 IC4.6
  Bottom 0.813: R10.2 83.66,7.35 BTN8.1
N$10  (via drill 0.6)
  Top 0.406: POT_2.P$2 37.5,30.9 36.85,31.55 23.08,31.55 19.59,35.04 19.59,40.82 15.46,44.95 9.8,44.95 6.83,47.92 v6.83,48.74 | v2.55,69.72 v2.55,69.73 6.05,73.23 14.52,73.23 17.74,76.45 17.74,82.38 14.12,86 v14.12,90.09 | v35.91,87.38 35.91,86.68 37.58,85.01 46.18,85.01 IC1.14
  Bottom 0.406: v6.83,48.74 6.63,48.81 7.12,48.81 10.31,52 16.28,52 17.9,53.62 17.9,55.66 15.69,57.87 4.76,57.87 2.58,60.05 2.58,69.69 v2.55,69.72 | v14.12,90.09 14.12,90.37 15.58,91.83 21.38,91.83 22.26,92.71 27.67,92.71 28.61,91.77 34.58,91.77 35.9,90.45 v35.9,87.39 v35.91,87.38
N$11  (via drill 0.6)
  Top 0.406: v69.95,43.28 69.95,68.66 72.01,70.72 72.01,77.93 64.07,85.87 64.07,87.7 62.65,89.12 62.65,89.13 v61.59,90.19 | v56.55,90.19 56.47,90.19 55.15,88.87 49.25,88.87 47.94,87.56 IC1.15
  Bottom 0.406: POT_3.P$2 62.5,30.97 64.3,32.77 67.33,32.77 69.94,35.38 v69.94,43.27 v69.95,43.28 | v61.59,90.19 v56.55,90.19
N$12  (via drill 0.6)
  Top 0.406: POT_4.P$2 87.5,41.01 80.4,48.11 80.4,65.3 80.39,65.31 80.39,74.49 v71.08,83.8 | v56.08,83.8 51.68,83.8 47.83,79.95 IC1.12
  Bottom 0.406: v71.08,83.8 v56.08,83.8
N$13  (via drill 0.6)
  Top 0.406: v1.99,71.26 v1.99,71.27 5.03,74.31 5.03,74.34 8.35,77.66 8.35,83.21 10.98,85.84 10.98,90 v11,90.02 | v37.35,97.58 40.11,97.58 46.2,91.49 49.6,91.49 50.98,90.11 IC1.1
  Bottom 0.406: POT_5.P$2 12.5,55.67 11.53,56.64 4.32,56.64 1.49,59.47 1.49,70.76 v1.99,71.26 | v11,90.02 11,92.3 16.17,97.47 16.17,97.48 16.26,97.57 v37.34,97.57 v37.35,97.58
N$14  (via drill 0.6)
  Top 0.406: POT_6.P$2 37.5,58 36.4,59.1 36.4,65.79 v37.4,66.79
  Bottom 0.406: v37.4,66.79 37.49,66.79 38.23,67.53 46.33,67.53 47.7,68.9 54.35,68.9 55.79,70.34 55.79,78.61 54.38,80.02 53.89,80.02 IC1.5
N$15
  Bottom 0.406: POT_7.P$2 62.5,58.43 63.01,58.94 63.01,65.28 58.68,69.61 58.68,75.63 56.89,77.42 56.89,79.41 55.74,80.56 55.74,80.57 55.08,81.23 52.54,81.23 51.65,82.12 51.65,86.78 52.45,87.58 IC1.2
N$16
  Bottom 0.406: POT_8.P$2 87.5,66.52 84.17,69.85 65.15,69.85 63.76,71.24 63.76,75.65 62.32,77.09 59.04,77.09 58.06,78.07 58.06,80.99 57.05,82 57.02,82 56.54,82.48 IC1.4
N$75  (via drill 0.6)
  Top 0.406: IC3.7 53.83,32.05 56.42,32.05 57.9,33.53 67.02,33.53 71.07,29.48 73.99,29.48 79.4,24.07 v79.4,20.53 | R8.1 83.66,11.91 v79.4,16.17
  Bottom 0.406: v79.4,16.17 v79.4,20.53
N$76
  Top 0.406: R7.1 59.95,11.78 64.92,16.75 70.19,16.75 71.19,17.75 81.73,17.75 82.96,16.52 85.46,16.52 86.87,17.93 86.87,19.37 84.15,22.09 82.69,22.09 74.51,30.27 71.68,30.27 67.37,34.58 53.84,34.58 IC3.6
N$77
  Top 0.406: IC3.5 51.73,37.15 50.86,36.28 50.86,31.19 50.02,30.35 48.14,30.35 47.69,30.8 44.5,30.8 37.63,23.93 35.74,23.93 34.09,22.28 33.13,22.28 32.19,21.34 32.19,13.23 R6.1
N$78  (via drill 0.6)
  Top 0.406: IC3.4 52.85,39.69 51.83,40.71 51.83,44.34 51.28,44.89 50.18,44.89 v50.14,44.93 | v44.13,40.97 40.99,40.97 40.97,40.99 32.98,40.99 v31.32,42.65 | R5.1 8.7,11.75 7.09,11.75 4.94,13.9 4.94,19.67 7.56,22.29 9.03,22.29 10.71,23.97 14.31,23.97 16.06,22.22 v17.87,22.22
  Bottom 0.406: v50.14,44.93 50.14,44.9 49.63,44.39 49.63,42.81 47.78,40.96 v44.14,40.96 v44.13,40.97 | v17.87,22.22 17.87,22.24 19.6,23.97 19.6,38.09 19.58,38.11 19.59,38.12 19.59,40.35 21.89,42.65 v31.32,42.65
N$79
  Top 0.406: R4.1 82.42,23.75 75.01,31.15 72.61,31.15 69.46,34.3 69.46,38.35 65.56,42.25 53.84,42.25 IC3.3
N$80  (via drill 0.6)
  Top 0.406: v64.4,43.71 64.4,43.81 63.42,44.79 53.84,44.79 IC3.2
  Bottom 0.406: 64.38,43.69 v64.4,43.71 64.42,43.69 64.42,36.53 64.4,36.51 64.37,36.51 58.14,30.28 58.14,28.09 58.69,27.54 R3.1
N$81  (via drill 0.6)
  Top 0.406: IC3.1 53.83,47.33 53.83,52.13 53.05,52.91 48.67,52.91 v48.65,52.89 | v46.51,52.9 45.34,52.9 44.78,52.34 44.78,50.29 44.21,49.72 33.96,49.72 30.13,45.89 30.16,45.86 v30.16,40.75 | R2.1 v31.04,23.76 v31.03,23.75
  Bottom 0.406: v46.51,52.9 v48.65,52.89 | v31.03,23.75 29.92,23.75 28.26,25.41 28.26,28.08 30.17,29.99 30.17,40.08 v30.16,40.75
N$82  (via drill 0.6)
  Top 0.406: IC3.15 v31.32,44.77 v31.31,44.76
  Bottom 0.406: v31.31,44.76 14.64,44.76 14.63,44.77 11.85,44.77 5.69,38.61 5.69,25.01 6.85,23.85 8.65,23.85 R1.1
N$83
  Bottom 0.813: LED1.A 14.7,22.2 R1.2
N$84
  Bottom 0.813: LED2.A 39.71,22.2 R2.2
N$85
  Bottom 0.813: LED4.A 89.78,22.2 R4.2
N$86
  Bottom 0.813: LED3.A 64.74,22.2 R3.2
N$87
  Bottom 0.813: LED5.A 14.77,10.21 R5.2
N$88
  Bottom 0.813: LED6.A 39.76,10.2 R6.2
N$89
  Bottom 0.813: LED7.A 64.75,10.21 R7.2
N$90
  Bottom 0.813: LED8.A 89.75,10.21 R8.2
N$274  (via drill 0.6)
  Top 0.406: POT_9.P$2 12.5,90.02 v12.52,90.04
  Bottom 0.406: v12.52,90.04 12.52,91.33 17.93,96.74 39.13,96.74 39.92,97.53 39.96,97.53 43.63,101.2 43.63,105.02 44.67,106.06 IC2.13
N$275
  Bottom 0.406: POT_10.P$2 37.5,90.37 41.18,94.05 41.19,94.05 41.42,94.28 48,94.28 50,96.28 50,98.41 49.12,99.29 49.12,107.25 47.78,108.59 IC2.14
N$276  (via drill 0.6)
  Top 0.406: POT_11.P$2 62.5,87.21 58.35,91.36 51.28,91.36 v49.9,92.74
  Bottom 0.406: IC2.15 48.23,111.12 49.9,109.45 49.9,99.82 51.16,98.56 51.16,94 v49.9,92.74
N$277  (via drill 0.6)
  Top 0.406: POT_12.P$2 87.5,91.62 85.32,93.8 85.27,93.8 84.7,94.37 50.85,94.37 v48.26,96.96
  Bottom 0.406: v48.26,96.96 48.26,102.86 47.62,103.5 IC2.12
N$278
  Bottom 0.406: IC2.1 53.71,114.87 54.52,115.68 54.52,117.23 53.47,118.28 16.36,118.28 12.43,114.35 12.43,104.57 POT_13.P$2
N$279
  Top 0.406: IC2.5 54.77,103.51 55.79,104.53 55.79,109.3 55.24,109.85 51.32,109.85 48.75,112.42 44.95,112.42 39.72,107.19 38.29,107.19 37.5,106.4 POT_14.P$2
N$280
  Top 0.406: POT_15.P$2 62.49,106.88 60.87,108.5 58.15,108.5 55.53,111.12 IC2.2
N$281
  Bottom 0.406: POT_16.P$2 87.5,105.13 86.51,106.12 53.78,106.12 IC2.4
SPI_CS1  (via drill 0.6)
  Top 0.406: IC4.1 53.82,23.72 56.37,26.27 | DIGITALIO.1 55.09,54.09 57.2,51.98 57.21,51.98 59.26,49.93 v59.84,49.93 | 56.37,26.26 56.37,26.27 | 56.37,26.27 56.91,26.81 v56.91,29.89 v56.9,29.9
  Bottom 0.406: CHAIN_OUT.1 54.98,63.35 53.83,62.2 53.83,56.45 DIGITALIO.1 | v56.9,29.9 56.9,30.51 61.5,35.11 61.5,49.2 60.77,49.93 v59.84,49.93
SPI_CS2  (via drill 0.6)
  Top 0.406: DIGITALIO.2 53.81,56.47 46.69,56.47 46.2,55.98 46.2,54.51 45.45,53.76 44.21,53.76 43.71,53.26 43.71,51.34 43.25,50.88 v41.85,50.88
  Bottom 0.406: DIGITALIO.2 56.25,57.74 56.26,57.75 57.19,57.75 60.59,61.15 60.59,63.68 58.38,65.89 CHAIN_OUT.2 | IC3.12 46.16,37.17 45.21,37.17 43.29,35.25 40.77,35.25 39.31,36.71 39.31,38.3 41.83,40.82 41.83,50.86 v41.85,50.88
SPI_MISO  (via drill 0.6)
  Top 0.406: v50.4,25.27 50.4,5.82 49.3,4.72 IC4.9 | v50.01,50.02 50.01,46.67 48.92,45.58 48.92,33.85 v49.46,33.31
  Bottom 0.406: DIGITALIO.6 50.01,57.72 51.27,56.45 51.27,51.28 v50.01,50.02 | v50.4,25.27 50.4,26.48 48.54,28.34 48.54,32.39 v49.46,33.31
SPI_MISO_CHAIN  (via drill 0.6)
  Top 0.406: 40.04,50.9 v40.02,50.88 v40.03,50.89 40.03,51.54 41.98,53.49 41.98,55.59 37.98,59.59 37.98,65.42 40.18,67.62 48.71,67.62 49.99,66.33 CHAIN_OUT.6
  Bottom 0.305: 46.17,7.27 IC4.10
  Bottom 0.406: 45.31,7.27 44.39,8.19 44.39,20.82 44.82,21.25 47.36,21.25 49.02,22.91 49.02,25.62 48.1,26.54 45.02,26.54 44,27.56 v44,32.18 44,33.01 42.69,34.32 40.38,34.32 38.32,36.38 38.32,38.96 40.04,40.68 40.04,50.86 v40.02,50.88 | R9.1 45.62,1.99 44.26,3.34 44.26,6.22 45.31,7.27 | 46.17,7.27 45.31,7.27
SPI_MOSI
  Bottom 0.406: DIGITALIO.8 47.47,57.73 48.71,56.48 48.71,54.53 49.86,53.38 49.86,51.83 48.68,50.65 48.68,43.12 | 48.71,43.15 48.68,43.12 | IC3.14 46.2,42.21 47.77,42.21 48.45,42.89 48.68,43.12
SPI_MOSI_CHAIN  (via drill 0.6)
  Top 0.406: IC3.9 46.22,29.5 50.24,29.5 51.62,30.88 51.62,32.65 52.33,33.36 55.87,33.36 v55.89,33.34 | v51.25,61.71 51.25,61.02 51.99,60.28 56.36,60.28 v59.21,57.43
  Bottom 0.406: CHAIN_OUT.8 47.45,66.47 48.63,67.64 50.39,67.64 51.29,66.74 v51.25,61.71 | v55.89,33.34 58.31,33.34 60.58,35.61 60.58,46.95 56.82,50.71 56.82,54.48 59.21,56.87 v59.21,57.43
SPI_SCLK  (via drill 0.6)
  Top 0.406: IC3.11 | IC3.11 46.59,34.6 v49.5,31.69 | DIGITALIO.7 47.47,51.9 48.71,50.65 48.71,46.64 48.11,46.04 48.11,35.08 47.69,34.66 46.24,34.66 IC3.11
  Bottom 0.406: CHAIN_OUT.7 47.14,63.35 46.19,62.4 46.19,56.48 DIGITALIO.7 | v49.5,31.69 49.5,30.5 55.79,24.21 55.79,20.49 55.25,19.95 IC4.2
VCC  (via drill 0.6)  (2 unrouted)
  Top 0.813: v3.72,4.78 3.72,3.94 6.98,0.68 6.99,0.68 7,0.67 20.09,0.67 | 20.09,0.67 44.05,0.67 | 44.05,0.67 54.74,0.67 | 54.74,0.67 69.96,0.67 | v19.28,2.98 19.3,1.46 20.09,0.67 | v43.25,2.86 43.25,1.47 44.05,0.67 | v69.01,2.65 69.01,1.62 69.96,0.67 | v93.48,2.65 93.48,1.38 92.77,0.67 69.96,0.67 | R9.2 53.85,1.55 54.74,0.67 | CHAIN_OUT.9 44.9,63.37 44.88,63.37 43.15,65.1 40.69,65.1 39.33,63.74 39.33,60.81 44.92,55.22 DIGITALIO.9 | ANALOG_1.9 67.63,74.87 69.59,72.91 69.59,71.14 67.1,68.65 7.01,68.65 3.79,65.43 3.79,55.5 | 3.79,55.5 3.79,30.13 5.5,28.42 5.5,28.41 6.44,27.47 14.24,27.47 | 14.24,27.47 39.29,27.47 40.01,28.19 POT_2.P$3 | POT_1.P$3 15,28.23 14.24,27.47 | v69.17,25.45 67.29,25.45 65.03,27.71 65.03,29.47 POT_3.P$3 | POT_4.P$3 90,27.32 v91.87,25.45 | POT_7.P$3 65,51.79 v66.64,50.15 | POT_8.P$3 90,51.81 v91.66,50.15 94.13,50.15 v98.14,54.16 | POT_6.P$3 40,53.55 38.88,52.43 14.08,52.43 | 14.08,52.43 6.86,52.43 3.79,55.5 | POT_5.P$3 15,53.35 14.08,52.43 | v5.02,119.9 40.12,119.9 | 40.12,119.9 92.68,119.9 v94.84,117.74 95.02,117.56 95.02,103.16 93.68,101.82 92.64,101.82 | 92.64,101.82 67.68,101.82 POT_15.P$3 | POT_16.P$3 90,104.46 92.64,101.82 | 40.12,119.9 43.74,116.28 43.8,116.28 46.09,113.99 IC2.16 47.42,115 C2.1
  Bottom 0.406: IC3.10 46.28,32.06 48.67,34.45 48.67,37.52 47.79,38.4 44.52,38.4 43.11,39.81 43.11,46.33 43.99,47.21 46.09,47.21 IC3.16
  Bottom 0.813: v3.72,4.78 3.72,39.76 12.13,48.17 14.4,48.17 | R13.1 17.57,8.76 | 17.57,8.76 17.61,8.76 19.32,7.05 19.32,3.44 v19.28,2.98 | R12.1 41.84,8.7 | 41.84,8.7 43.25,7.29 v43.25,2.86 | R11.1 67.06,8.8 | 67.06,8.8 67.31,8.8 69.01,7.11 v69.01,2.65 | v93.48,2.65 93.49,2.91 93.49,7.05 91.78,8.77 R10.1 93.76,11.25 93.76,19.33 92.39,20.7 R14.1 | R15.1 67.11,20.7 69.12,18.68 69.12,10.87 67.06,8.8 | R16.1 41.76,20.7 43.42,19.04 43.42,18.94 | 43.42,18.94 43.42,10.28 41.84,8.7 | R17.1 16.93,20.7 18.81,18.82 18.81,9.99 17.57,8.76 | 43.42,18.94 43.36,19 43.36,21.5 43.53,21.67 43.53,21.68 44.34,22.5 IC4.16 47.37,23.67 C4.2 | C3.2 47.47,48.58 IC3.16 46.19,47.46 45.35,48.3 45.35,54.77 DIGITALIO.9 44.92,55.09 42.27,52.43 38.85,52.43 34.59,48.17 14.4,48.17 | 14.4,48.17 14.43,48.14 | ANALOG_1.9 93.84,74.87 98.14,70.57 v98.14,54.16 98.14,29.24 94.35,25.45 v91.87,25.45 v69.17,25.45 | 39.24,77.49 41.91,77.49 42.58,76.82 ANALOG_2.9 42.5,74.95 42.5,82.69 40.45,84.74 40.45,84.75 39.12,86.08 39.12,88.79 40.44,90.11 IC1.16 47.27,91.18 C1.1 | 39.24,77.49 14.17,77.49 | 14.17,77.49 6.12,77.49 4.14,79.47 4.14,105.17 | 4.14,105.17 4.14,119.02 v5.02,119.9 | POT_10.P$3 40,78.25 39.24,77.49 | POT_9.P$3 15,78.32 14.17,77.49 | POT_14.P$3 40,102.93 39.11,102.04 13.84,102.04 | 13.84,102.04 7.27,102.04 4.14,105.17 | POT_13.P$3 14.99,103.19 13.84,102.04 | POT_11.P$3 65,78.42 66.12,77.3 66.16,77.3 66.28,77.18 91.21,77.18 | 91.21,77.18 94.78,77.18 98.64,81.04 98.64,113.94 v94.84,117.74 | POT_12.P$3 90,78.39 91.21,77.18 | v66.64,50.15 v91.66,50.15

### Text on the board
Bottom: uMODULAR ctrl16 rev. 0.1 / CC-BY-SA 4 Romulo Silva http://midilab.co
tValues: uMODULAR ctrl16 rev. 0.1 / CC-BY-SA 4 Romulo Silva http://midilab.co | 10kb | 10kb | 10kb | 10kb | ANALOG_13 | ANALOG_14 | ANALOG_15 | ANALOG_16 | 10kb | 10kb | 10kb | 10kb | ANALOG_9 | ANALOG_10 | ANALOG_11 | ANALOG_12 | 10kb | 10kb | 10kb | 10kb | ANALOG_5 | ANALOG_6 | ANALOG_7 | ANALOG_8 | 10kb | 10kb | 10kb | 10kb | ANALOG_1 | ANALOG_2 | ANALOG_3 | ANALOG_4